# EAGLE design PowerShield (EAGLE 6.5.0)
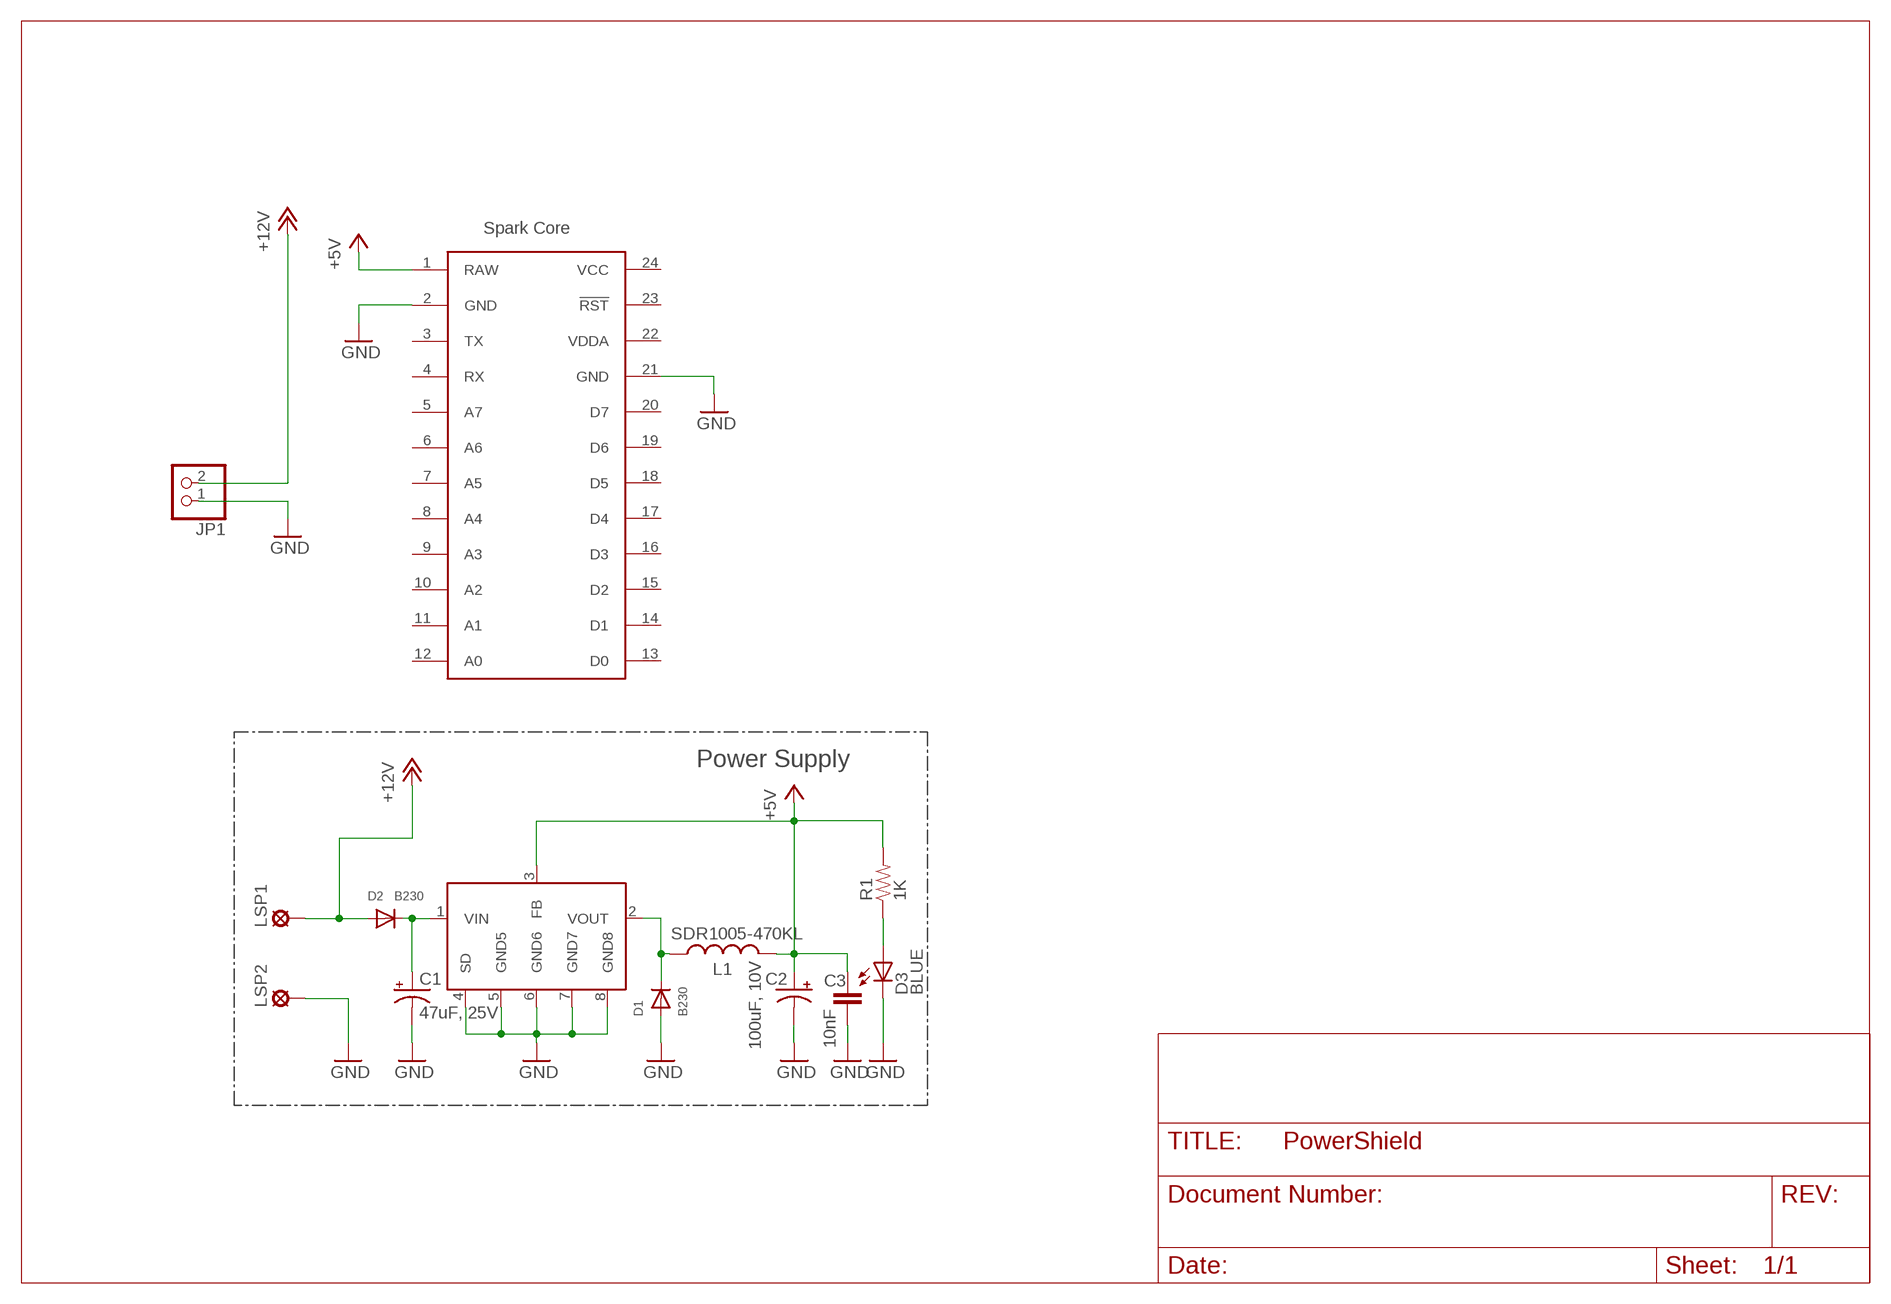
[diagram p0: schematic, sheet 1]

## Parts
C1  47uF, 25V  CAP_POLD  [PANASONIC_D]
C2  100uF, 10V  CAP_POLD  [PANASONIC_D]
C3  10nF  CAP0603-CAP  [0603-CAP]
D1  B230  DIODESMA  [SMADIODE]
D2  B230  DIODESMA  [SMADIODE]
D3  BLUE  LED0603  [LED-0603]
JP1  PINHD-1X2  [1X02]
L1  SDR1005-470KL  INDUCTOR-SPARKFUN  [INDUCTOR-SDR1005-470KL]
LSP1  SE14  [SE14]
LSP2  SE14  [SE14]
R1  1K  RESISTOR0603-RES  [0603-RES]
U1  AP1509-50SG-13  [SO08]
U$2  SPARK_CORECORE  [SPARK_CORE]

## Nets
+5V: C2.+ C3.2 L1.P$2 R1.2 U1.3(FB) U$2.1(RAW)
+12V: D2.A JP1.2 LSP1.MP
GND: C1.- C2.- C3.1 D1.A D3.C JP1.1 LSP2.MP U1.4(SD) U1.5(GND5) U1.6(GND6) U1.7(GND7) U1.8(GND8) U$2.2(GND) U$2.21(GND)
N$1: D3.A R1.1
N$2: C1.+ D2.C U1.1(VIN)
N$34: D1.C L1.P$1 U1.2(VOUT)
Unconnected: U$2.3(TX) U$2.4(RX) U$2.5(A7) U$2.6(A6) U$2.7(A5) U$2.8(A4) U$2.9(A3) U$2.10(A2) U$2.11(A1) U$2.12(A0) U$2.13(D0) U$2.14(D1) U$2.15(D2) U$2.16(D3) U$2.17(D4) U$2.18(D5) U$2.19(D6) U$2.20(D7) U$2.23(!RST)

## Notes on the sheet
- Spark Core
- Power Supply

## Power pins joined to a net without a drawn wire
VCC: U$2.24(VCC)
VDDA: U$2.22(VDDA)

## Library data of the parts
C1 C2 = SparkFun-Capacitors:CAP_POL: Capacitor Polarized These are standard SMD and PTH capacitors. Normally 10uF, 47uF, and 100uF in electrolytic and tantalum varieties. Always verify the external diameter of the through hole cap, it varies with capacity, voltage, and manufacturer. The EIA devices should be standard.
C3 = SparkFun-Capacitors:CAP: Capacitor Standard 0603 ceramic capacitor, and 0.1" leaded capacitor.
D1 D2 = adafruit:DIODE: Diode SMADIODE - SMA Surface Mount Package 20V 1A Schottky Diode Digikey: 641-1014-6-ND DO-1N4148 - Through Hole Small Current Diode SOD-123 20V 1 A (.5mV Vf) Schottky Diode - Digikey: MBRX120TPMSCT-ND SOD-323 10V 570mA (.38mV Vf, 3ns) Schottky Diode - Digikey: ZLLS410CT-ND SOD-523 30V 30mA Schottky Diode (RB751S-40TE61) - Digikey: RB751S-40TE61CT-ND SOT23-R/W - SOT23 Package (R = Solder Paste/Reflow Ovens, W = Hand-Soldering) BAT54Film 40V 300mA - Digikey: 497-7162-1-ND
D3 = SparkFun-LED:LED: LEDs Standard schematic elements and footprints for 5mm, 3mm, 1206, and 0603 sized LEDs. 5mm - Spark Fun Electronics SKU : COM-00529 (and others)
JP1 = pinhead:PINHD-1X2: PIN HEADER
L1 = Spark:INDUCTOR-SPARKFUN: Inductors Basic Inductor/Choke - 0603 and 1206. Footprints are not proven and vary greatly between part numbers. SRN6045- 33uH, 20% 1.4A
LSP1 LSP2 = solpad:SE14: SOLDER PAD E1553, drill 1,4mm, distributor Buerklin, 07F820
R1 = SparkFun-Passives:RESISTOR: Resistor Basic schematic elements and footprints for 0603, 1206, and PTH resistors.
U1 = Spark:AP1509-50SG-13
U$2 = Spark:SPARK_CORE

## Board
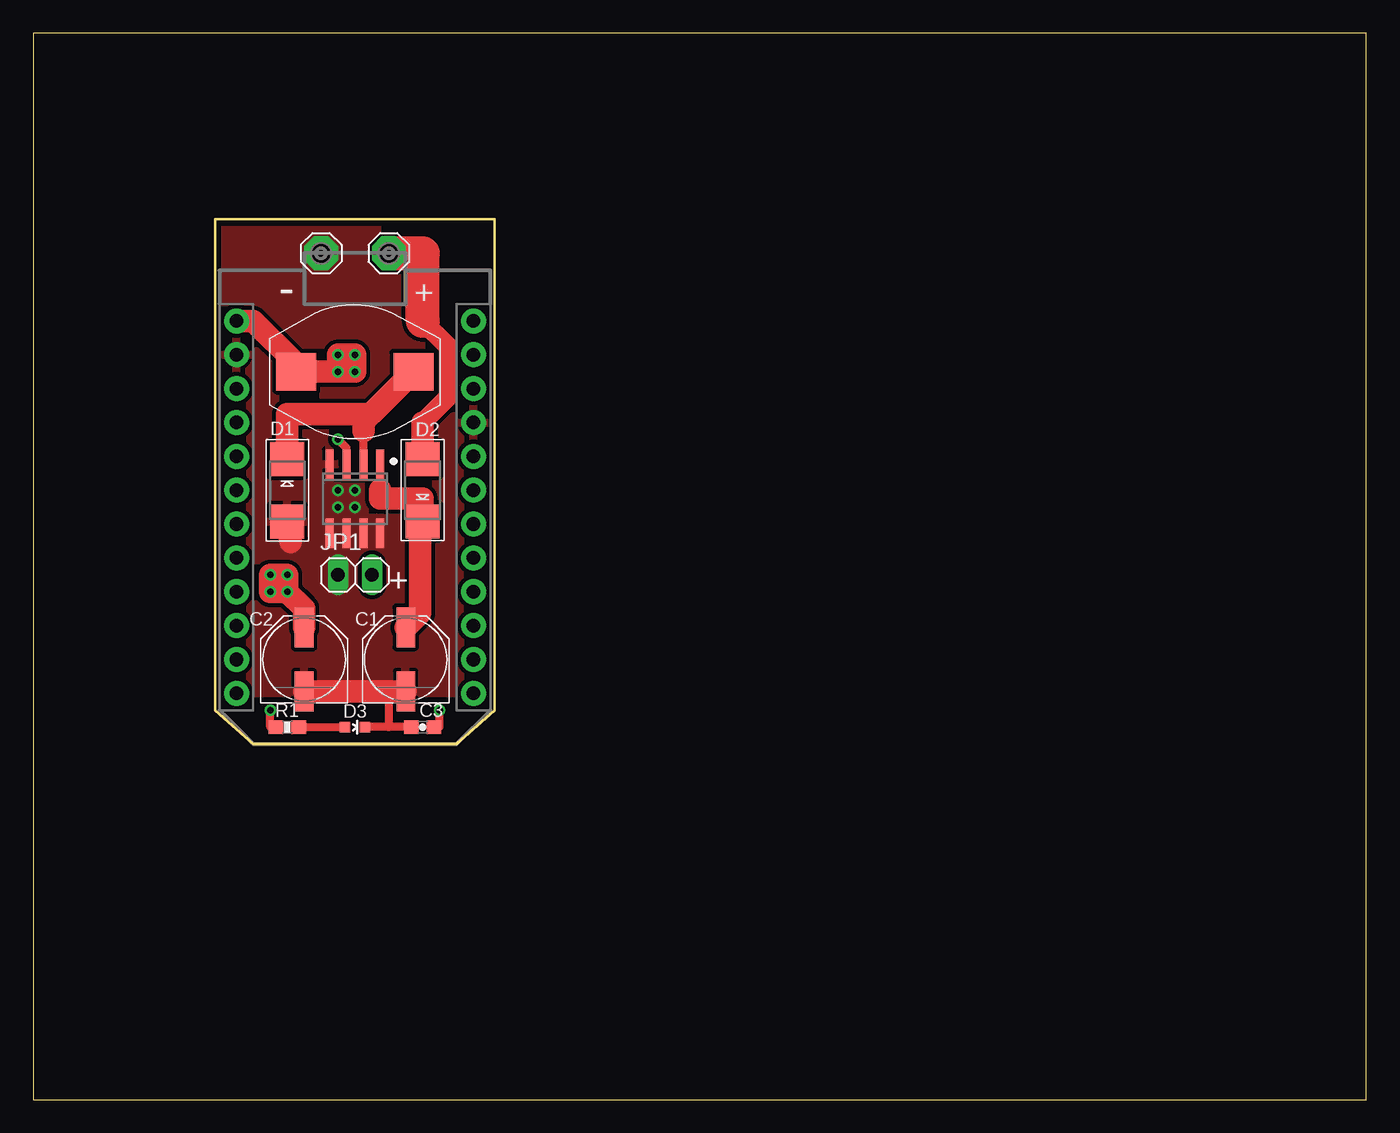
[diagram p1: board, top side]
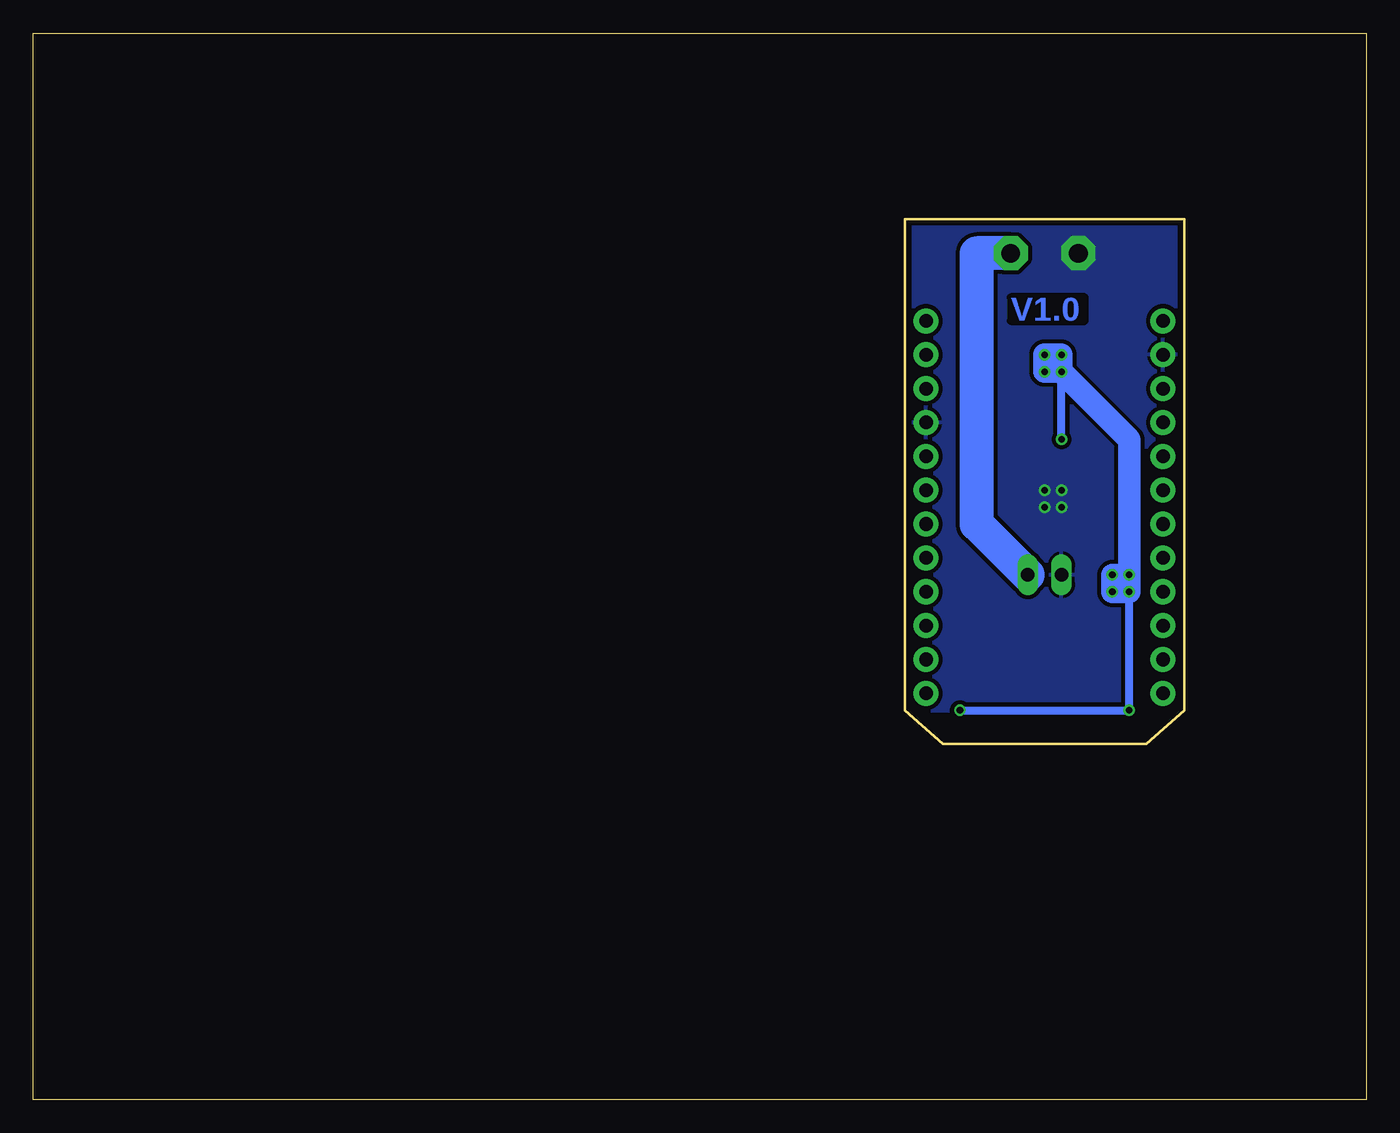
[diagram p2: board, bottom side, seen from below]

Size 100 x 80 mm. Coordinates in mm from the lower left corner, seen from the top.
Outline: 0,0 100,0 100,80 0,80 0,0
Outline: 13.65,66.04 34.61,66.04 34.61,29.21 31.75,26.67 16.51,26.67 13.65,29.21 13.65,66.04
Copper layers (1*16): Top 0.0356mm / dielectric 1.5011mm / Bottom 0.0356mm
Design rules "LaenPCBOrder": minimum track width 6mil, minimum drill 13mil, track to track 6mil, track to pad 6mil, pad to pad 6mil, via to via 6mil, smd to smd 6mil, copper to edge 15mil, drill to drill 6mil, minimum pad ring 7mil, minimum via ring 7mil, stop-mask expansion 3mil, vias tented up to drill 0mil, thermal gap 10mil

### Footprints (pad centres in the part's own frame; a part is rotated, then mirrored left to right if it is on the bottom)
PANASONIC_D = smd 3 x 1.4: + 2.4,0; - -2.4,0
0603-CAP = smd 1.1 x 1: 1 -0.85,0; 2 0.85,0
SMADIODE = smd 2.54 x 2.54: A 2.349,0; C -2.349,0
LED-0603 = smd 0.8 x 0.8: A 0,-0.75; C 0,0.75
1X02 = drill 1.016 long: 1 -1.27,0; 2 1.27,0
INDUCTOR-SDR1005-470KL = smd 3 x 2.8: P$1 -4.4,0; P$2 4.4,0
SE14 = drill 1.397 pad 2.54 octagon: MP 0,0
0603-RES = smd 1.1 x 1: 1 -0.85,0; 2 0.85,0
SO08 = smd 0.6 x 2.2: 1 -1.905,-2.6; 2 -0.635,-2.6; 3 0.635,-2.6; 4 1.905,-2.6; 5 1.905,2.6; 6 0.635,2.6; 7 -0.635,2.6; 8 -1.905,2.6
SPARK_CORE = drill 1.016 pad 1.88: 1 -8.89,13.97; 2 -8.89,11.43; 3 -8.89,8.89; 4 -8.89,6.35; 5 -8.89,3.81; 6 -8.89,1.27; 7 -8.89,-1.27; 8 -8.89,-3.81; 9 -8.89,-6.35; 10 -8.89,-8.89; 11 -8.89,-11.43; 12 -8.89,-13.97; 13 8.89,-13.97; 14 8.89,-11.43; 15 8.89,-8.89; 16 8.89,-6.35; 17 8.89,-3.81; 18 8.89,-1.27; 19 8.89,1.27; 20 8.89,3.81; 21 8.89,6.35; 22 8.89,8.89; 23 8.89,11.43; 24 8.89,13.97

### Placement (x,y rotation side)
C1  27.94,33.02 90 top
C2  20.32,33.02 90 top
C3  29.21,27.94 0 top
D1  19.05,45.72 270 top
D2  29.21,45.72 90 top
D3  24.13,27.94 270 top
JP1  24.13,39.37 0 top
L1  24.13,54.61 180 top
LSP1  26.67,63.5 0 top
LSP2  21.59,63.5 0 top
R1  19.05,27.94 180 top
U1  24.13,45.09 180 top
U$2  24.13,44.45 0 top

### Tracks (layer width: path | path; a pad name or v marks a point on that pad's centre or on a via)
+5V  (via drill 0.5)
  Top 0.61: 19.68,55.24 19.68,54.66 L1.P$2 | U1.3 23.5,48.9 v22.86,49.53 | R1.2 17.78,27.94 v17.78,29.21 | C3.2 30.48,27.94 v30.48,29.21
  Top 1.676: U$2.1 16.51,58.42 19.68,55.24 | L1.P$2 v22.86,54.61 | v22.86,54.61 v24.13,54.61 v24.13,55.88 v22.86,55.88 v22.86,54.61 | v17.78,39.37 v19.05,39.37 v19.05,38.1 | v19.05,38.1 v17.78,38.1 v17.78,39.37 | v17.78,39.37 v19.05,38.1 | v19.05,38.1 20.32,36.83 C2.+
  Bottom 0.61: v22.86,49.53 v22.86,54.61 | v17.78,38.1 v17.78,29.21 v30.48,29.21
  Bottom 1.676: v22.86,54.61 v22.86,55.88 v24.13,55.88 v24.13,54.61 v22.86,54.61 | v22.86,54.61 17.78,49.53 v17.78,39.37 | v17.78,39.37 v17.78,38.1 v19.05,38.1 v19.05,39.37 v17.78,39.37
+12V
  Top 1.422: 29.21,58.42 31.11,56.52 31.11,52.7 29.21,50.8
  Top 1.676: 29.21,50.8 D2.A
  Top 2.54: LSP1.MP 29.21,63.5 29.21,58.42
  Bottom 2.54: LSP1.MP 29.21,63.5 29.21,43.18 JP1.2
GND  (via drill 0.5)
  Top 0.254: C1.- 27.8,30.48 26.67,30.48
  Top 0.61: C3.1 26.67,27.94 | 26.67,27.94 D3.C | 26.67,30.48 26.67,27.94
  Top 1.676: C2.- C1.- | 19.3,41.85 D1.A
  other vias: 22.86,45.72 24.13,45.72 22.86,44.45 24.13,44.45
  pour Bottom (isolate 0.305): 13.97,66.04 34.29,66.04 34.29,29.21 13.97,29.21
  pour Top (isolate 0.305): 13.97,66.04 34.29,66.04 34.29,31.75 31.75,30.48 16.51,30.48 13.97,31.75
  pour Top (no thermals): 19.05,66.04 24.13,66.04 24.13,60.96 19.05,60.96
  pour Bottom (no thermals): 19.05,66.04 24.13,66.04 24.13,60.96 19.05,60.96
  pour Top (isolate 0.305, no thermals): 21.59,44.45 21.59,36.83 26.67,36.83 26.67,43.81 24.77,43.81 24.77,44.13 24.45,44.45
N$1
  Top 0.61: R1.1 D3.A
N$2
  Top 0.61: 26.04,45.72 U1.1
  Top 1.676: 26.04,45.72 26.04,45.09 29.21,45.09 D2.C 29.02,42.1 29.02,36.5 C1.+
N$34
  Top 0.61: U1.2 24.77,50.16
  Top 1.676: D1.C 19.05,51.44 25.36,51.44 | 25.36,51.44 L1.P$1 | 24.77,50.16 24.77,50.84 25.36,51.44

### Text on the board
Bottom: V1.0
tPlace: - | + | + | C2 | C1